# Altium project LIFT_DRIVER.PrjPcb
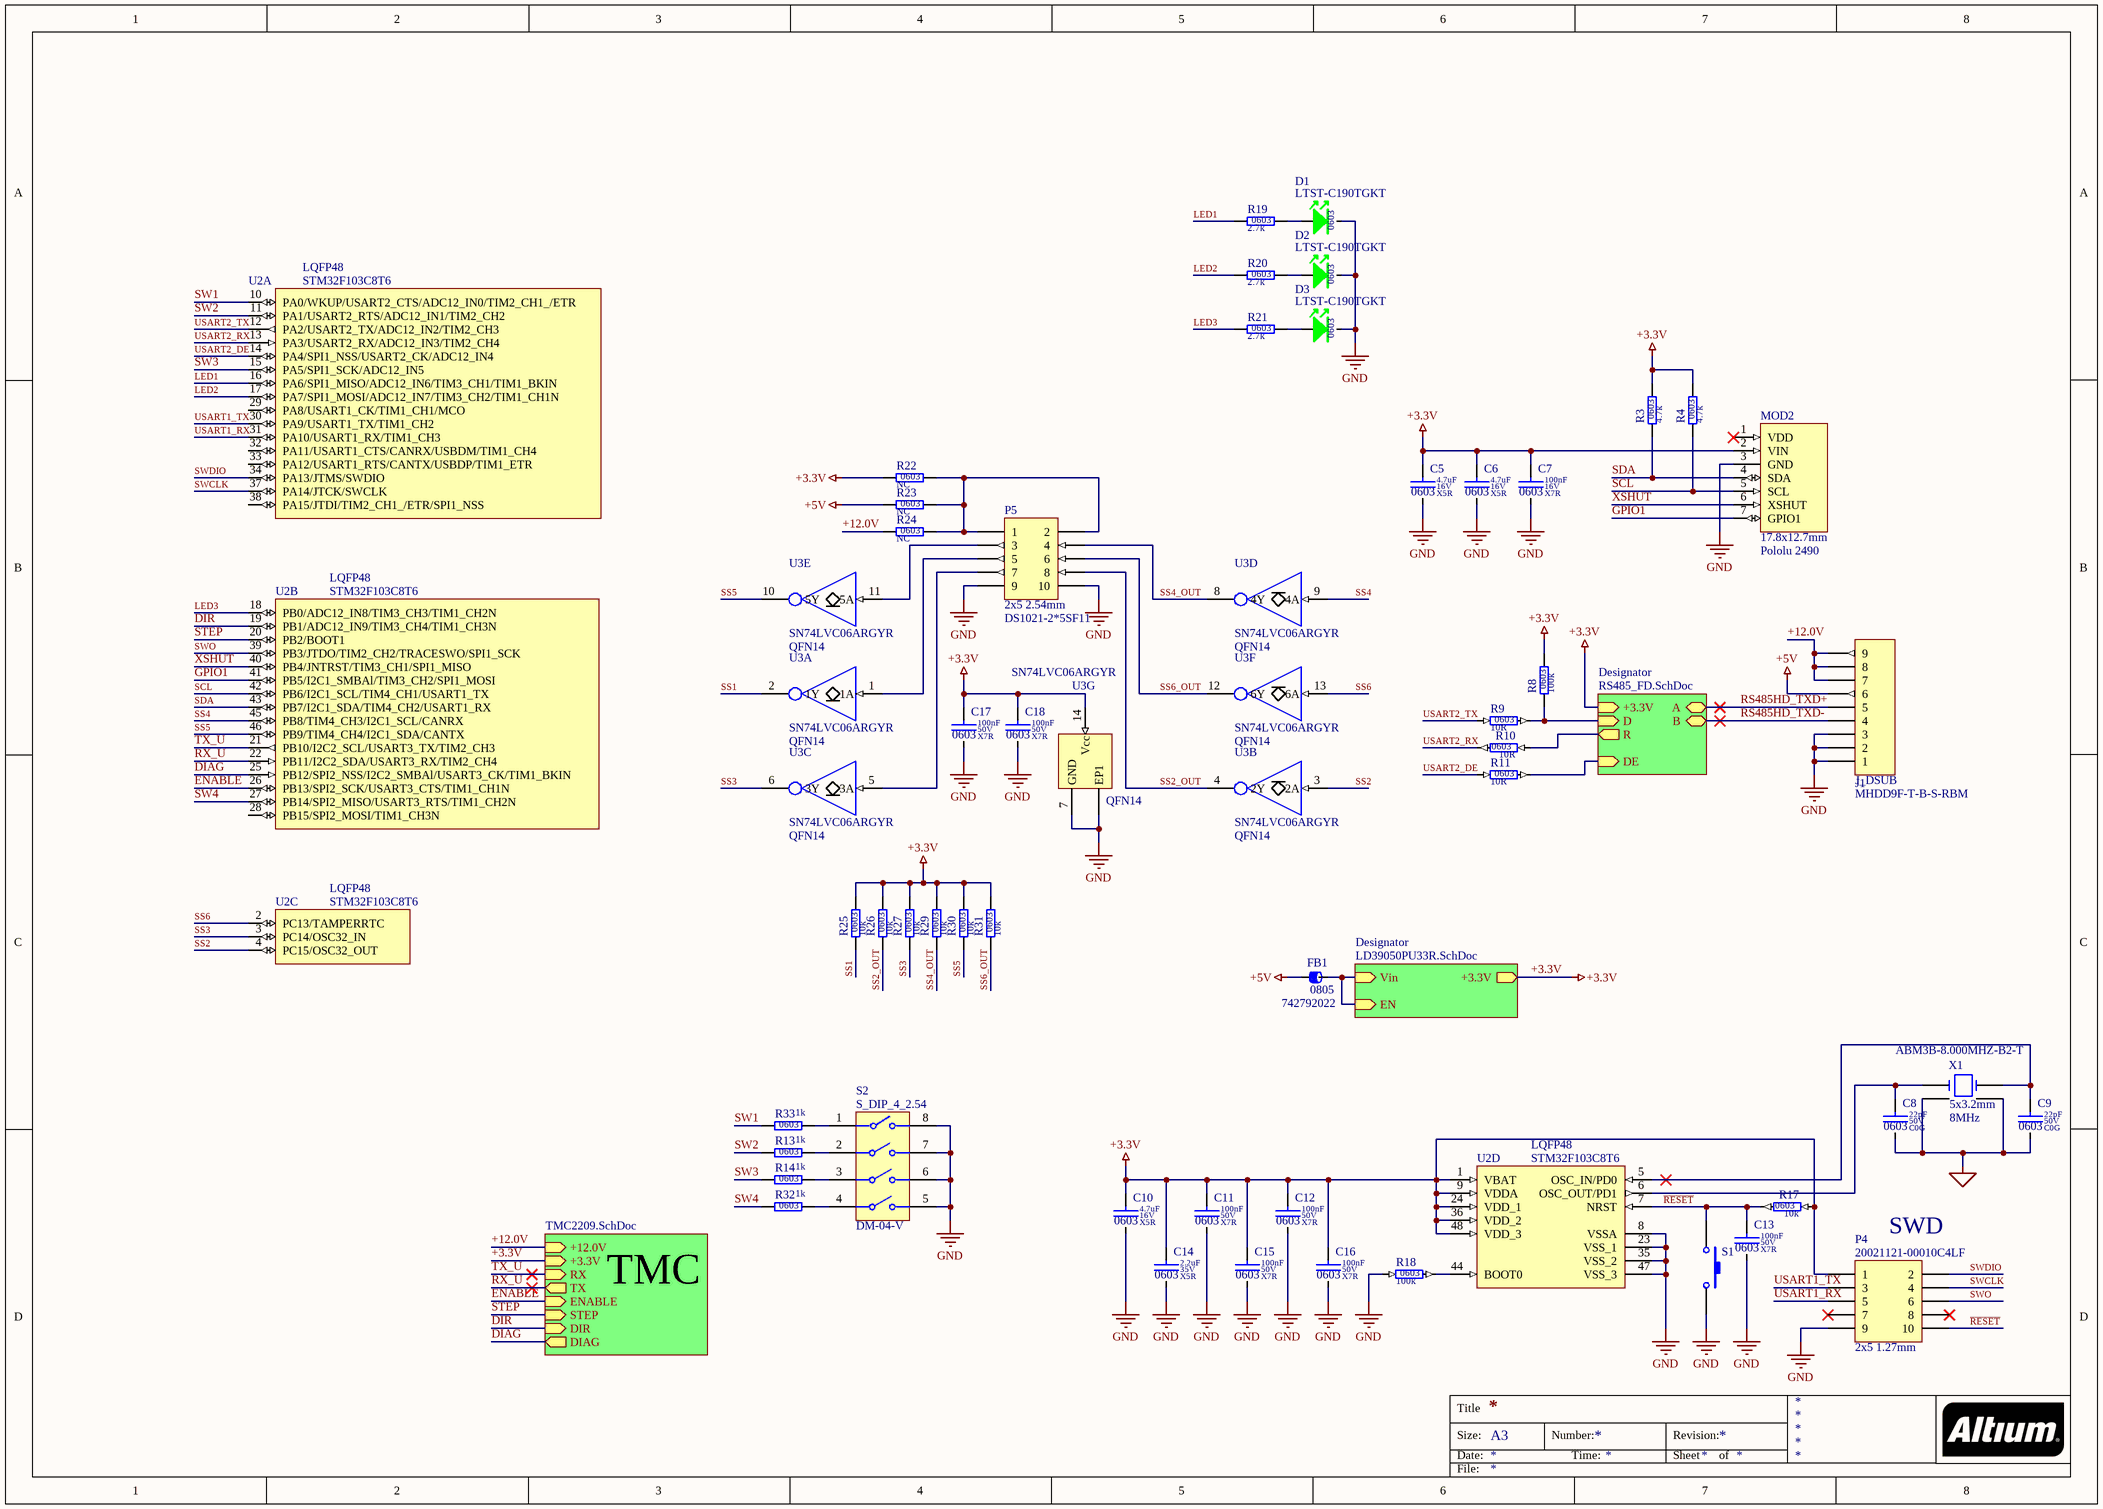
[diagram p0: LIFT_DRIVER.SchDoc]
4 sheets, 84 parts. Net scope: hierarchical (ports join the sheet entries above them; power ports are global).
Board file: LIFT_DRIVER.PcbDoc
Sheets:
  LIFT_DRIVER.SchDoc
    Designator = TMC2209.SchDoc
    Designator = LD39050PU33R.SchDoc
  protection.SchDoc

## Sheet LIFT_DRIVER.SchDoc
size A3

### Parts
C5  value 4.7uF  Dielectric: X5R  Voltage: 16V  SCH_Footprint: 0603  [C_0603_1608]  (hidden comment: Ceramic X5R)
C6  value 4.7uF  Dielectric: X5R  Voltage: 16V  SCH_Footprint: 0603  [C_0603_1608]  (hidden comment: Ceramic X5R)
C7  value 100nF  Dielectric: X7R  Voltage: 16V  SCH_Footprint: 0603  [C_0603_1608]  (hidden comment: Ceramic X7R)
C8  value 22pF  Dielectric: C0G  Voltage: 50V  SCH_Footprint: 0603  [C_0603_1608]  (hidden comment: Ceramic C0G)
C9  value 22pF  Dielectric: C0G  Voltage: 50V  SCH_Footprint: 0603  [C_0603_1608]  (hidden comment: Ceramic C0G)
C10  value 4.7uF  Dielectric: X5R  Voltage: 16V  SCH_Footprint: 0603  [C_0603_1608]  (hidden comment: Ceramic X5R)
C11  value 100nF  Dielectric: X7R  Voltage: 50V  SCH_Footprint: 0603  [C_0603_1608]  (hidden comment: Ceramic X7R)
C12  value 100nF  Dielectric: X7R  Voltage: 50V  SCH_Footprint: 0603  [C_0603_1608]  (hidden comment: Ceramic X7R)
C13  value 100nF  Dielectric: X7R  Voltage: 50V  SCH_Footprint: 0603  [C_0603_1608]  (hidden comment: Ceramic X7R)
C14  value 2.2uF  Dielectric: X5R  Voltage: 35V  SCH_Footprint: 0603  [C_0603_1608]  (hidden comment: Ceramic X5R)
C15  value 100nF  Dielectric: X7R  Voltage: 50V  SCH_Footprint: 0603  [C_0603_1608]  (hidden comment: Ceramic X7R)
C16  value 100nF  Dielectric: X7R  Voltage: 50V  SCH_Footprint: 0603  [C_0603_1608]  (hidden comment: Ceramic X7R)
C17  value 100nF  Dielectric: X7R  Voltage: 50V  SCH_Footprint: 0603  [C_0603_1608]  (hidden comment: Ceramic X7R)
C18  value 100nF  Dielectric: X7R  Voltage: 50V  SCH_Footprint: 0603  [C_0603_1608]  (hidden comment: Ceramic X7R)
D1  value LTST-C190TGKT  SCH_Footprint: 0603  [OL_0603_1608]  (hidden comment: Green Led)
D2  value LTST-C190TGKT  SCH_Footprint: 0603  [OL_0603_1608]  (hidden comment: Green Led)
D3  value LTST-C190TGKT  SCH_Footprint: 0603  [OL_0603_1608]  (hidden comment: Green Led)
FB1  value 742792022  SCH_Footprint: 0805  [FB_0805_2012]  (hidden comment: Ferrite bead)
J1  value MHDD9F-T-B-S-RBM  [J_DSUB_MHDD9F-T-B-S-RBM]  (hidden comment: DSUB 9 Pin)
MOD2  value Pololu 2490  SCH_Footprint: 17.8x12.7mm  [MOD_VL53L0X]  (hidden comment: time-of-flight)
P4  value 20021121-00010C4LF  SCH_Footprint: 2x5 1.27mm  [P_HEADER_2x5_1.27]  (hidden comment: Jtag)
P5  value DS1021-2*5SF11  SCH_Footprint: 2x5 2.54mm  [P_HEADER_2x5_2.54]  (hidden comment: Goldpin male)
R3  value 4.7k  SCH_Footprint: 0603  [R_0603_1608]  (hidden comment: Resistor)
R4  value 4.7k  SCH_Footprint: 0603  [R_0603_1608]  (hidden comment: Resistor)
R8  value 100k  SCH_Footprint: 0603  [R_0603_1608]  (hidden comment: Resistor)
R9  value 10R  SCH_Footprint: 0603  [R_0603_1608]  (hidden comment: Resistor)
R10  value 10R  SCH_Footprint: 0603  [R_0603_1608]  (hidden comment: Resistor)
R11  value 10R  SCH_Footprint: 0603  [R_0603_1608]  (hidden comment: Resistor)
R13  value 1k  SCH_Footprint: 0603  [R_0603_1608]  (hidden comment: Resistor)
R14  value 1k  SCH_Footprint: 0603  [R_0603_1608]  (hidden comment: Resistor)
R17  value 10k  SCH_Footprint: 0603  [R_0603_1608]  (hidden comment: Resistor)
R18  value 100k  SCH_Footprint: 0603  [R_0603_1608]  (hidden comment: Resistor)
R19  value 2.7k  SCH_Footprint: 0603  [R_0603_1608]  (hidden comment: Resistor)
R20  value 2.7k  SCH_Footprint: 0603  [R_0603_1608]  (hidden comment: Resistor)
R21  value 2.7k  SCH_Footprint: 0603  [R_0603_1608]  (hidden comment: Resistor)
R22  value NC  SCH_Footprint: 0603  [R_NC_0603_1608]  (hidden comment: Resistor)
R23  value NC  SCH_Footprint: 0603  [R_NC_0603_1608]  (hidden comment: Resistor)
R24  value NC  SCH_Footprint: 0603  [R_NC_0603_1608]  (hidden comment: Resistor)
R25  value 10k  SCH_Footprint: 0603  [R_0603_1608]  (hidden comment: Resistor)
R26  value 10k  SCH_Footprint: 0603  [R_0603_1608]  (hidden comment: Resistor)
R27  value 10k  SCH_Footprint: 0603  [R_0603_1608]  (hidden comment: Resistor)
R29  value 10k  SCH_Footprint: 0603  [R_0603_1608]  (hidden comment: Resistor)
R30  value 10k  SCH_Footprint: 0603  [R_0603_1608]  (hidden comment: Resistor)
R31  value 10k  SCH_Footprint: 0603  [R_0603_1608]  (hidden comment: Resistor)
R32  value 1k  SCH_Footprint: 0603  [R_0603_1608]  (hidden comment: Resistor)
R33  value 1k  SCH_Footprint: 0603  [R_0603_1608]  (hidden comment: Resistor)
S1  3x6mm  [S_TACTSWITCH3x6]  (value not drawn)
S2  value DM-04-V  SCH_Footprint: S_DIP_4_2.54  [DM-04-V]  (hidden comment: DIP SWITCH 4 POS)
U2  SCH_Footprint: LQFP48  [LQFP48_7x7]  (hidden comment: STM32F103C8T6)  (parts A,B,C,D of 4)
U3  value SN74LVC06ARGYR  SCH_Footprint: QFN14  [QFN14_4x4]  (hidden comment: Open drain buffer)  (parts A,B,C,D,E,F,G of 7)
X1  Manufacturer Part Number: ABM3B-8.000MHZ-B2-T  SCH_Footprint: 5x3.2mm  [X_ABM3B_5X3X11]  (hidden comment: 8MHz)

### Sub-sheets
Designator = RS485_FD.SchDoc (file not in this document): +3.3V (in), R (out), D (in), DE (in), A (bidir), B (bidir)
Designator = TMC2209.SchDoc: TX (out), +3.3V (in), RX (in), DIR (in), STEP (in), +12.0V (in), DIAG (out), ENABLE (in)
Designator = LD39050PU33R.SchDoc: Vin (in), +3.3V (out), EN (in)

### Nets
+3.3V: C5.1 C6.1 C7.1 C10.1 C11.1 C12.1 C14.1 C15.1 C16.1 C17.1 C18.1 MOD2.2(VIN) P4.1 R3.2 R4.2 R8.2 R17.1 R22.1 R25.2 R26.2 R27.2 R29.2 R30.2 R31.2 U2.1(VBAT) U2.9(VDDA) U2.24(VDD_1) U2.36(VDD_2) U2.48(VDD_3) U3.14(Vcc) ; sheet Designator/+3.3V, sheet Designator/+3.3V, sheet Designator/+3.3V
+5V: FB1.1 J1.6 R23.1
GND: C5.2 C6.2 C7.2 C8.2 C9.2 C10.2 C11.2 C12.2 C13.2 C14.2 C15.2 C16.2 C17.2 C18.2 D1.1(K) D2.1(K) D3.1(K) J1.1 J1.2 J1.3 MOD2.3(GND) P4.9 P5.9 P5.10 R18.1 S1.2 S2.5 S2.6 S2.7 S2.8 U2.8(VSSA) U2.23(VSS_1) U2.35(VSS_2) U2.47(VSS_3) U3.7(GND) U3.EP1 X1.2(GND) X1.4(GND)
+12.0V: J1.7 J1.8 J1.9 R24.1 ; sheet Designator/+12.0V
DIAG: U2.25(PB12/SPI2_NSS/I2C2_SMBAl/USART3_CK/TIM1_BKIN) ; sheet Designator/DIAG
DIR: U2.19(PB1/ADC12_IN9/TIM3_CH4/TIM1_CH3N) ; sheet Designator/DIR
ENABLE: U2.26(PB13/SPI2_SCK/USART3_CTS/TIM1_CH1N) ; sheet Designator/ENABLE
GPIO1: MOD2.7(GPIO1) U2.41(PB5/I2C1_SMBAl/TIM3_CH2/SPI1_MOSI)
LD_IN: FB1.2 ; sheet Designator/Vin, sheet Designator/EN
LED1: R19.1 U2.16(PA6/SPI1_MISO/ADC12_IN6/TIM3_CH1/TIM1_BKIN)
LED2: R20.1 U2.17(PA7/SPI1_MOSI/ADC12_IN7/TIM3_CH2/TIM1_CH1N)
LED3: R21.1 U2.18(PB0/ADC12_IN8/TIM3_CH3/TIM1_CH2N)
~{RESET}: C13.1 P4.10 R17.2 S1.1 U2.7(NRST)
RS485HD_TXD+: J1.5 ; sheet Designator/A
RS485HD_TXD-: J1.4 ; sheet Designator/B
RX_U: U2.22(PB11/I2C2_SDA/USART3_RX/TIM2_CH4) ; sheet Designator/TX
SCL: MOD2.5(SCL) R4.1 U2.42(PB6/I2C1_SCL/TIM4_CH1/USART1_TX)
SDA: MOD2.4(SDA) R3.1 U2.43(PB7/I2C1_SDA/TIM4_CH2/USART1_RX)
SS1: R25.1 U3.2(1Y)
SS2: U2.4(PC15/OSC32_OUT) U3.3(2A)
SS2_OUT: P5.8 R26.1 U3.4(2Y)
SS3: R27.1 U2.3(PC14/OSC32_IN) U3.6(3Y)
SS4: U2.45(PB8/TIM4_CH3/I2C1_SCL/CANRX) U3.9(4A)
SS4_OUT: P5.4 R29.1 U3.8(4Y)
SS5: R30.1 U2.46(PB9/TIM4_CH4/I2C1_SDA/CANTX) U3.10(5Y)
SS6: U2.2(PC13/TAMPERRTC) U3.13(6A)
SS6_OUT: P5.6 R31.1 U3.12(6Y)
STEP: U2.20(PB2/BOOT1) ; sheet Designator/STEP
SW1: R33.1 U2.10(PA0/WKUP/USART2_CTS/ADC12_IN0/TIM2_CH1_/ETR)
SW2: R13.1 U2.11(PA1/USART2_RTS/ADC12_IN1/TIM2_CH2)
SW3: R14.1 U2.15(PA5/SPI1_SCK/ADC12_IN5)
SW4: R32.1 U2.27(PB14/SPI2_MISO/USART3_RTS/TIM1_CH2N)
SWCLK: P4.4 U2.37(PA14/JTCK/SWCLK)
SWDIO: P4.2 U2.34(PA13/JTMS/SWDIO)
SWO: P4.6 U2.39(PB3/JTDO/TIM2_CH2/TRACESWO/SPI1_SCK)
TX_U: U2.21(PB10/I2C2_SCL/USART3_TX/TIM2_CH3) ; sheet Designator/RX
USART1_RX: P4.5 U2.31(PA10/USART1_RX/TIM1_CH3)
USART1_TX: P4.3 U2.30(PA9/USART1_TX/TIM1_CH2)
USART2_DE: R11.1 U2.14(PA4/SPI1_NSS/USART2_CK/ADC12_IN4)
USART2_RX: R10.2 U2.13(PA3/USART2_RX/ADC12_IN3/TIM2_CH4)
USART2_TX: R9.1 U2.12(PA2/USART2_TX/ADC12_IN2/TIM2_CH3)
XSHUT: MOD2.6(XSHUT) U2.40(PB4/JNTRST/TIM3_CH1/SPI1_MISO)
NetC8_1: C8.1 U2.6(OSC_OUT/PD1) X1.3
NetC9_1: C9.1 U2.5(OSC_IN/PD0) X1.1
NetD1_2: D1.2(A) R19.2
NetD2_2: D2.2(A) R20.2
NetD3_2: D3.2(A) R21.2
NetP5_1: P5.1 P5.2 R22.2 R23.2 R24.2
NetP5_3: P5.3 U3.11(5A)
NetP5_5: P5.5 U3.1(1A)
NetP5_7: P5.7 U3.5(3A)
NetR8_1: R8.1 R9.2 ; sheet Designator/D
NetR10_1: R10.1 ; sheet Designator/R
NetR11_2: R11.2 ; sheet Designator/DE
NetR13_2: R13.2 S2.2
NetR14_2: R14.2 S2.3
NetR18_2: R18.2 U2.44(BOOT0)
NetR32_2: R32.2 S2.4
NetR33_2: R33.2 S2.1

Not connected (* = marked no-connect by the designer): J1 0(NC); MOD2 1(VDD)*; P4 7* 8*; U2 28(PB15/SPI2_MOSI/TIM1_CH3N) 29(PA8/USART1_CK/TIM1_CH1/MCO) 32(PA11/USART1_CTS/CANRX/USBDM/TIM1_CH4) 33(PA12/USART1_RTS/CANTX/USBDP/TIM1_ETR) 38(PA15/JTDI/TIM2_CH1_/ETR/SPI1_NSS)

### Notes on the sheet
- (near P4) SWD
- TMC
- Title
- Size:
- Date:
- A3
- Number:
- Time:
- Revision:
- Sheet
- of
- File:

### Library data of the parts
C5 C6 C10 = C_4.7uF_16V_X5R_0603_10: Capacitor; Manufacturer: Murata; Manufacturer Part Number: GRM188R61C475KAAJD; Tolerance (%): 10; Part Number: C_4.7uF_16V_X5R_0603_10; HelpURL: https://datasheet.octopart.com/GRM188R61C475KAAJD-Murata-datasheet-66077093.pdf; Supplier 1: TME; Supplier 2: RS Components; Supplier Part Number 2: 884-7264P; Supplier 3: Farnell; Supplier Part Number 3: 2611924; Supplier 4: Mouser; Supplier Part Number 4: 81-GRM188R61C475KAJD; Supplier 5: Digi-Key; Supplier Part Number 5: 490-10481-2-ND
  C5 C6: Supplier 6: LCSC
C7 = C_100nF_16V_X7R_0603_10: Capacitor; Manufacturer: Kemet; Manufacturer Part Number: C0603C104K4RAC7013; Tolerance (%): 10; Part Number: C_100nF_16V_X7R_0603_10; HelpURL: https://pl.mouser.com/datasheet/2/212/KEM_C1002_X7R_SMD-1102033.pdf; Supplier 1: TME; Supplier 2: RS Components; Supplier 3: Farnell; Supplier 4: Mouser; Supplier Part Number 4: 80-C0603C104K4RC7013; Supplier 5: Digi-Key; Supplier Part Number 5: 399-7372-2-ND; Supplier 6: LCSC
C8 C9 = C_22pF_50V_C0G_0603_5: Capacitor; Manufacturer: AVX; Manufacturer Part Number: 06035A220JAT2A; Tolerance (%): 5; Part Number: C_22pF_50V_C0G_0603_5; HelpURL: https://datasheet.octopart.com/06035A220JAT2A-AVX-datasheet-9883399.pdf; Supplier 1: TME; Supplier 2: RS Components; Supplier Part Number 2: 1349628; Supplier 3: Farnell; Supplier Part Number 3: 2280861; Supplier 4: Mouser; Supplier Part Number 4: 581-06035A220J; Supplier 5: Digi-Key; Supplier Part Number 5: 478-1167-1-ND
C11-C13 C15-C18 = C_100nF_50V_X7R_0603_5: Capacitor; Manufacturer: Samsung; Manufacturer Part Number: CL10B104JB8NNNC; Tolerance (%): 5; Part Number: C_100nF_50V_X7R_0603_5; HelpURL: http://www.tme.eu/pl/Document/4a42202b32dab16128fe107dd69598cc/samsung-chip-cap.pdf; Supplier 1: TME; Supplier Part Number 1: CL10B104JB8NNNC; Supplier 2: RS Components; Supplier 3: Farnell; Supplier 4: Mouser; Supplier 5: Digi-Key
C14 = C_2.2uF_35V_X5R_0603_10: Capacitor; Manufacturer: Murata; Manufacturer Part Number: GRM188R6YA225KA12D; Tolerance (%): 10; Part Number: C_2.2uF_35V_X5R_0603_10; HelpURL: https://datasheet.octopart.com/GRM188R6YA225KA12D-Murata-datasheet-66077095.pdf; Supplier 1: TME; Supplier 2: RS Components; Supplier Part Number 2: 8151358; Supplier 3: Farnell; Supplier Part Number 3: 2611926; Supplier 4: Mouser; Supplier Part Number 4: 81-GRM188R6YA225KA2D; Supplier 5: Digi-Key; Supplier Part Number 5: 490-7204-1-ND
D1-D3 = OL_G_0603: LED GREEN; Manufacturer: Lite-On; Part Number: OL_G_0603; HelpURL: https://datasheet.octopart.com/LTST-C190TGKT-Lite-On-datasheet-158437.pdf; Manufacturer Part Number: LTST-C190TGKT; Supplier 1: TME; Supplier Part Number 1: LTST-C190TGKT; Supplier 2: RS Components; Supplier Part Number 2: 6920997P; Supplier 3: Farnell; Supplier 4: Mouser; Supplier Part Number 4: 859-LTST-C190TGKT; Supplier 5: Digi-Key; Supplier Part Number 5: 160-2019-1-ND
FB1 = FB_742792022: Manufacturer: Wurth; Current: 2A; Resistance: 50mR; Part Number: FB_742792022; HelpURL: http://www.farnell.com/datasheets/1919973.pdf?_ga=2.197269935.1851800069.1516124392-930414557.1508304960; Manufacturer Part Number: 742792022; Supplier 1: TME; Supplier 2: RS Components; Supplier 3: Farnell; Supplier Part Number 3: 1635733; Supplier 4: Mouser; Supplier 5: Digi-Key
J1 = J_DSUB: Header, 9-Pin; SCH_Footprint: J_DSUB; Part Number: J_DSUB; Component Type: Standard; HelpURL: https://www.tme.eu/Document/d24efe21bdaa08410b5ca50a678e1de1/MHDDXX-F-T-B-S-RBM.PDF; Manufacturer: -; Manufacturer Part Number: MHDD9F-T-B-S-RBM; Supplier 1: TME; Supplier Part Number 1: MHDD9F-T-B-S-RBM; Supplier 2: RS Components; Supplier 3: Farnell; Supplier Part Number 3: 2533067; Supplier 4: Mouser; Supplier 5: Digi-Key
MOD2 = MOD_VL53L0X: Pin Header; Manufacturer: Polulu; Part Number: MOD_VL53L0X; HelpURL: https://www.pololu.com/file/download/VL53L0X.pdf?file_id=0J1187; Manufacturer Part Number: Pololu 2490; Supplier 1: TME; Supplier 2: RS Components; Supplier 3: Farnell; Supplier 4: Mouser; Supplier 5: Digi-Key; Supplier 6: LCSC; Supplier 7: Botland; Supplier Part Number 7: PLL-07176
P4 = P_HEADER_2x5_1.27: Header, 10-Pin, Dual row; Manufacturer: FCI; Part Number: P_HEADER_2x5_1.27; Component Type: Standard; HelpURL: http://www.mouser.com/catalog/645/usd/1591.pdf; Manufacturer Part Number: 20021121-00010C4LF; Supplier 1: TME; Supplier Part Number 1: 20021121-00010C4LF; Supplier 2: RS Components; Supplier Part Number 2: 794-4584; Supplier 3: Farnell; Supplier Part Number 3: 1865279; Supplier 4: Mouser; Supplier Part Number 4: 649-202112100010C4LF; Supplier 5: Digi-Key; Supplier Part Number 5: 609-3695-1-ND
P5 = P_HEADER_2x5_2.54: Pin Header; Manufacturer: Connfly; Part Number: P_HEADER_2x5_2.54; Component Type: Standard; HelpURL: https://www.tme.eu/Document/cc301e58a5da78cb543a94b5a5b7f06a/DS1021.pdf; Manufacturer Part Number: DS1021-2*5SF11; Supplier 1: TME; Supplier Part Number 1: ZL202-10G; Supplier 2: RS Components; Supplier 3: Farnell; Supplier 4: Mouser; Supplier 5: Digi-Key
R3 R4 = R_4.7k_0603_1: Manufacturer: Yageo; Manufacturer Part Number: RC0603FR-074K7L; Voltage: 75V; Power: 100mW; Tolerance: 1%; Part Number: R_4.7k_0603_1; HelpURL: http://www.farnell.com/datasheets/2167052.pdf?_ga=2.156163131.1690599162.1548417389-1379097396.1542296996&_gac=1.18389067.1547230258.Cj0KCQiAmuHhBRD0ARIsAFWyPwhX8HcvXnM3tA0ZBodZLzDIjH2ZxLpjT5LWo9bad_HPRbU8LfPq44UaAhEwEALw_wcB; Supplier 1: TME; Supplier Part Number 1: RC0603FR-074K7; Supplier 2: RS Components; Supplier 3: Farnell; Supplier Part Number 3: 9238565; Supplier 4: Mouser; Supplier Part Number 4: 603-RC0603FR-074K7L; Supplier 5: Digi-Key; Supplier Part Number 5: 311-4.70KHRCT-ND; Supplier 6: LCSC
R8 R18 = R_100k_0603_1: Manufacturer: Royalohm; Manufacturer Part Number: 0603SAF1003T5E; Voltage: 50V; Power: 100mW; Tolerance: 1%; Part Number: R_100k_0603_1; HelpURL: http://www.tme.eu/pl/Document/b315665a56acbc42df513c99b390ad98/ROYALOHM-THICKFILM.pdf; Supplier 1: TME; Supplier Part Number 1: SMD0603-100K-1%; Supplier 2: RS Components; Supplier 3: Farnell; Supplier 4: Mouser; Supplier Part Number 4: 667-ERJ-3EKF1003V; Supplier 5: Digi-Key; Supplier Part Number 5: P100KHCT-ND
  R8: Supplier 6: LCSC
R9-R11 = R_10R_0603_1: Manufacturer: Royalohm; Manufacturer Part Number: 0603SAF100JT5E; Voltage: 50V; Power: 100mW; Tolerance: 1%; Part Number: R_10R_0603_1; HelpURL: http://www.tme.eu/pl/Document/b315665a56acbc42df513c99b390ad98/ROYALOHM-THICKFILM.pdf; Supplier 1: TME; Supplier Part Number 1: SMD0603-10R-1%; Supplier 2: RS Components; Supplier 3: Farnell; Supplier 4: Mouser; Supplier 5: Digi-Key
R13 R14 R32 R33 = R_1k_0603_1: Manufacturer: Vishay; Manufacturer Part Number: CRCW06031K00FKEA; Voltage: 75V; Power: 100mW; Tolerance: 1%; Part Number: R_1k_0603_1; HelpURL: http://www.farnell.com/datasheets/2310790.pdf?_ga=2.256888843.1690599162.1548417389-1379097396.1542296996&_gac=1.262631934.1547230258.Cj0KCQiAmuHhBRD0ARIsAFWyPwhX8HcvXnM3tA0ZBodZLzDIjH2ZxLpjT5LWo9bad_HPRbU8LfPq44UaAhEwEALw_wcB; Supplier 1: TME; Supplier 2: RS Components; Supplier Part Number 2: 678-9875P; Supplier 3: Farnell; Supplier Part Number 3: 1469740; Supplier 4: Mouser; Supplier Part Number 4: 71-CRCW0603-1.0K-E3; Supplier 5: Digi-Key; Supplier Part Number 5: 541-1.00KHCT-ND; Supplier 6: LCSC
R17 R25-R27 R29-R31 = R_10k_0603_1: Manufacturer: Vishay; Manufacturer Part Number: CRCW060310K0FKTABC; Voltage: 75V; Power: 100mW; Tolerance: 1%; Part Number: R_10k_0603_1; HelpURL: http://www.tme.eu/pl/Document/622e28308c06d160637f2b14751ba16b/Data%20Sheet%20CRCW_BCe3.pdf; Supplier 1: TME; Supplier Part Number 1: CRCW060310K0FKTABC; Supplier 2: RS Components; Supplier 3: Farnell; Supplier 4: Mouser; Supplier Part Number 4: 667-ERJ-3EKF1002V; Supplier 5: Digi-Key; Supplier Part Number 5: P10KGCT-ND
  R25-R27 R29-R31: Supplier 6: LCSC
R19-R21 = R_2.7k_0603_1: Manufacturer: Royalohm; Manufacturer Part Number: 0603SAF2701T5E; Voltage: 50V; Power: 100mW; Tolerance: 1%; Part Number: R_2.7k_0603_1; HelpURL: http://www.tme.eu/pl/Document/b315665a56acbc42df513c99b390ad98/ROYALOHM-THICKFILM.pdf; Supplier 1: TME; Supplier Part Number 1: SMD0603-2K7-1%; Supplier 2: RS Components; Supplier 3: Farnell; Supplier 4: Mouser; Supplier 5: Digi-Key
R22-R24 = R_GENERIC_0603: Part Number: R_GENERIC_0603; Supplier 1: TME; Supplier 2: RS Components; Supplier 3: Farnell; Supplier 4: Mouser; Supplier 5: Digi-Key
S1 = S_TACTSWITCH: Tact Switch; Manufacturer: Ninigi; Manufacturer Part Number: TACTM-34N-F; Part Number: S_TACTSWITCH; HelpURL: http://pl.ninigi.com/product/tactm-34n-f/pdf; Supplier 1: TME; Supplier Part Number 1: TACTM-34N-F; Supplier 2: RS Components; Supplier 3: Farnell; Supplier 4: Mouser; Supplier 5: Digi-Key
S2 = S_DM-04-V: Manufacturer: DIPTRONICS; Part Number: S_DM-04-V; HelpURL: https://www.tme.eu/pl/Document/3859235cbbc3386afa52bad431a134f4/DM-SERIES.pdf; Manufacturer Part Number: DM-04-V; Supplier 1: TME; Supplier Part Number 1: ESD104E; Supplier 2: RS Components; Supplier 3: Farnell; Supplier 4: Mouser; Supplier Part Number 4: 113-DM04VTR; Supplier 5: Digi-Key; Supplier 6: LCSC
U2 = UP_STM32F103C8T6: Manufacturer: STMicroelectronics; Value: STM32F103C8T6; Part Number: UP_STM32F103C8T6; HelpURL: https://datasheet.octopart.com/STM32F103C8T6-STMicroelectronics-datasheet-48026265.pdf; Manufacturer Part Number: STM32F103C8T6; Supplier 1: TME; Supplier Part Number 1: STM32F103C8T6; Supplier 2: RS Components; Supplier Part Number 2: 1023545; Supplier 3: Farnell; Supplier Part Number 3: 1447637; Supplier 4: Mouser; Supplier Part Number 4: 511-STM32F103C8T6; Supplier 5: Digi-Key; Supplier Part Number 5: 497-6063-ND; Supplier 6: LCSC
U3 = U_SN74LVC06ARGYR: Manufacturer: Texas Instruments; Part Number: U_SN74LVC06ARGYR; HelpURL: http://www.ti.com/lit/ds/symlink/sn74lvc06a.pdf; Manufacturer Part Number: SN74LVC06ARGYR; Supplier 1: TME; Supplier 2: RS Components; Supplier 3: Farnell; Supplier 4: Mouser; Supplier Part Number 4: 595-SN74LVC06ARGYR; Supplier 5: Digi-Key; Supplier Part Number 5: 296-13957-1-ND
X1 = X_ABM3B-8.000MHZ-B2-T: Manufacturer: Abracon; Part Number: X_ABM3B-8.000MHZ-B2-T; Value: 8MHz; HelpURL: https://datasheet.octopart.com/ABM3B-8.000MHZ-B2-T-Abracon-datasheet-12510201.pdf; Supplier 1: TME; Supplier Part Number 1: ABM3B-8.000MHZ-B2; Supplier 2: RS Components; Supplier Part Number 2: 171-0644; Supplier 3: Farnell; Supplier Part Number 3: 2467818; Supplier 4: Mouser; Supplier Part Number 4: 815-ABM3B-8.0-B2-T; Supplier 5: Digi-Key; Supplier Part Number 5: 535-9720-1-ND

## Sheet TMC2209.SchDoc
size A4
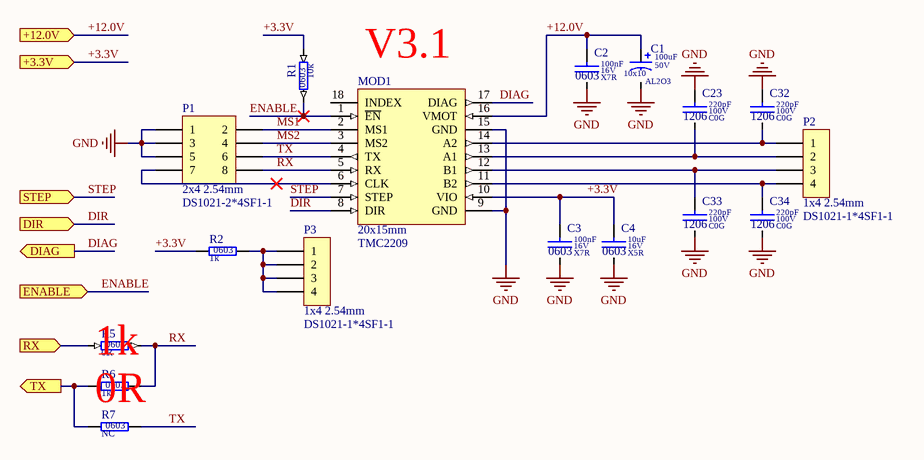
[diagram p1: TMC2209.SchDoc]

### Parts
C1  value 100uF  Dielectric: AL2O3  SCH_Footprint: 10x10  Voltage: 50V  [CE_D_10x10MM]  (hidden comment: Electrolytic Capacitor)
C2  value 100nF  Dielectric: X7R  Voltage: 16V  SCH_Footprint: 0603  [C_0603_1608]  (hidden comment: Ceramic X7R)
C3  value 100nF  Dielectric: X7R  Voltage: 16V  SCH_Footprint: 0603  [C_0603_1608]  (hidden comment: Ceramic X7R)
C4  value 10uF  Dielectric: X5R  Voltage: 16V  SCH_Footprint: 0603  [C_0603_1608]  (hidden comment: Ceramic X5R)
C23  value 220pF  Dielectric: C0G  Voltage: 100V  SCH_Footprint: 1206  [C_1206_3216]  (hidden comment: Ceramic C0G)
C32  value 220pF  Dielectric: C0G  Voltage: 100V  SCH_Footprint: 1206  [C_1206_3216]  (hidden comment: Ceramic C0G)
C33  value 220pF  Dielectric: C0G  Voltage: 100V  SCH_Footprint: 1206  [C_1206_3216]  (hidden comment: Ceramic C0G)
C34  value 220pF  Dielectric: C0G  Voltage: 100V  SCH_Footprint: 1206  [C_1206_3216]  (hidden comment: Ceramic C0G)
MOD1  value TMC2209  SCH_Footprint: 20x15mm  [MOD_TMC2209]  (hidden comment: The TMC2209 is an ultra-silent motor driver IC for two phase stepper motors.)
P1  value DS1021-2*4SF1-1  SCH_Footprint: 2x4 2.54mm  [P_HEADER_2x4_2.54]  (hidden comment: Goldpin male)
P2  value DS1021-1*4SF1-1  SCH_Footprint: 1x4 2.54mm  [P_HEADER_1x4_2.54]  (hidden comment: Goldpin)
P3  value DS1021-1*4SF1-1  SCH_Footprint: 1x4 2.54mm  [P_HEADER_1x4_2.54]  (hidden comment: Goldpin)
R1  value 10k  SCH_Footprint: 0603  [R_0603_1608]  (hidden comment: Resistor)
R2  value 1k  SCH_Footprint: 0603  [R_0603_1608]  (hidden comment: Resistor)
R5  value 0R  SCH_Footprint: 0603  [R_0603_1608]  (hidden comment: Resistor)
R6  value 1k  SCH_Footprint: 0603  [R_0603_1608]  (hidden comment: Resistor)
R7  value NC  SCH_Footprint: 0603  [R_NC_0603_1608]  (hidden comment: Resistor)

### Ports
+3.3V (in), +12.0V (in), DIAG (out), DIR (in), ENABLE (in), RX (in), STEP (in), TX (out)

### Nets
+3.3V: C3.1 C4.1 MOD1.10(VIO) R1.1 R2.1 ; port +3.3V
GND: C1.2 C2.2 C3.2 C4.2 C23.1 C32.1 C33.2 C34.2 MOD1.9(GND) MOD1.15(GND) P1.1 P1.3 P1.5
+12.0V: C1.1 C2.1 MOD1.16(VMOT) ; port +12.0V
DIAG: MOD1.17(DIAG) ; port DIAG
DIR: MOD1.8(DIR) ; port DIR
ENABLE: MOD1.1(~{EN}) R1.2 ; port ENABLE
MS1: MOD1.2(MS1) P1.2
MS2: MOD1.3(MS2) P1.4
RX: MOD1.5(RX) P1.8 R5.2 R6.2
RX_U: R6.1 R7.1 ; port TX
STEP: MOD1.7(STEP) ; port STEP
TX: MOD1.4(TX) P1.6 R7.2
TX_U: R5.1 ; port RX
NetC23_2: C23.2 MOD1.13(A1) P2.2
NetC32_2: C32.2 MOD1.14(A2) P2.1
NetC33_1: C33.1 MOD1.12(B1) P2.3
NetC34_1: C34.1 MOD1.11(B2) P2.4
NetMOD1_6: MOD1.6(CLK) P1.7
NetP3_1: P3.1 P3.2 P3.3 P3.4 R2.2

Not connected (* = marked no-connect by the designer): MOD1 18(INDEX)

### Notes on the sheet
- (near MOD1) V3.1
- (near R5) 1k
- (near R6) 0R

### Library data of the parts
C1 = CE_100uF_50V_AL2O3_10x10_20: Polarized Capacitor; Manufacturer: Nichicon; Manufacturer Part Number: UUX1H101MNL1GS; Tolerance (%): 20; Part Number: CE_100uF_50V_AL2O3_10x10_20; HelpURL: https://datasheet.octopart.com/UUX1H101MNL1GS-Nichicon-datasheet-62047998.pdf; Supplier 1: TME; Supplier Part Number 1: UUX1H101MNL1GS; Supplier 2: RS Components; Supplier Part Number 2: 739-3107; Supplier 3: Farnell; Supplier Part Number 3: 2841943; Supplier 4: Mouser; Supplier Part Number 4: 647-UUX1H101MNL1GS; Supplier 5: Digi-Key; Supplier Part Number 5: 493-6269-1-ND; Supplier 6: LCSC
C2 C3 = C_100nF_16V_X7R_0603_10: as C7 on sheet LIFT_DRIVER; Part Number: C_100nF_16V_X7R_0603_10; HelpURL: https://pl.mouser.com/datasheet/2/212/KEM_C1002_X7R_SMD-1102033.pdf; Supplier 1: TME; Supplier 2: RS Components; Supplier 3: Farnell; Supplier 4: Mouser; Supplier Part Number 4: 80-C0603C104K4RC7013; Supplier 5: Digi-Key; Supplier Part Number 5: 399-7372-2-ND; Supplier 6: LCSC
C4 = C_10uF_16V_X5R_0603_20: Capacitor; Manufacturer: Samsung Electro-Mechanics; Manufacturer Part Number: CL10A106MO8NQNC; Tolerance (%): 20; Part Number: C_10uF_16V_X5R_0603_20; HelpURL: http://www.tme.eu/pl/Document/4a42202b32dab16128fe107dd69598cc/samsung-chip-cap.pdf; Supplier 1: TME; Supplier Part Number 1: CL10A106MO8NQNC; Supplier 2: RS Components; Supplier 3: Farnell; Supplier 4: Mouser; Supplier 5: Digi-Key; Supplier 6: LCSC
C23 C32-C34 = C_220pF_100V_C0G_1206_5: Capacitor; Manufacturer: AVX; Manufacturer Part Number: 12061A221JAT2A; Tolerance (%): 5; Part Number: C_220pF_100V_C0G_1206_5; HelpURL: https://datasheet.octopart.com/12061A221JAT2A-AVX-datasheet-9883399.pdf; Supplier 1: TME; Supplier Part Number 1: 12061A221JAT2A; Supplier 2: RS Components; Supplier Part Number 2: 1364313; Supplier 3: Farnell; Supplier Part Number 3: 499286; Supplier 4: Mouser; Supplier Part Number 4: 581-12061A221J; Supplier 5: Digi-Key; Supplier Part Number 5: 478-1446-1-ND; Supplier 6: LCSC
MOD1 = MOD_TMC2209: Manufacturer: Trinamic; Part Number: MOD_TMC2209; HelpURL: https://www.trinamic.com/fileadmin/assets/Products/ICs_Documents/TMC2209_Datasheet_V103.pdf; Manufacturer Part Number: TMC2209; Supplier 1: TME; Supplier 2: RS Components; Supplier 3: Farnell; Supplier Part Number 3: 3131532; Supplier 4: Mouser; Supplier Part Number 4: 700-TMC2209SILENTSTE; Supplier 5: Digi-Key; Supplier Part Number 5: 1460-1395-ND; Supplier 6: LCSC
P1 = P_HEADER_2x4_2.54: Pin Header; Manufacturer: Connfly; Part Number: P_HEADER_2x4_2.54; HelpURL: https://www.tme.eu/Document/cc301e58a5da78cb543a94b5a5b7f06a/DS1021.pdf; Manufacturer Part Number: DS1021-2*4SF1-1; Supplier 1: TME; Supplier Part Number 1: ZL202-8G; Supplier 2: RS Components; Supplier 3: Farnell; Supplier 4: Mouser; Supplier 5: Digi-Key; Supplier 6: LCSC
P2 P3 = P_HEADER_1x4_2.54: Pin Header; Manufacturer: Connfly; Part Number: P_HEADER_1x4_2.54; HelpURL: http://datasheet.octopart.com/DS1021-1%2A4SF1-1-Connfly-datasheet-65537859.pdf; Manufacturer Part Number: DS1021-1*4SF1-1; Supplier 1: TME; Supplier Part Number 1: ZL201-04G; Supplier 2: RS Components; Supplier 3: Farnell; Supplier 4: Mouser; Supplier 5: Digi-Key; Supplier 6: LCSC
R1 = R_10k_0603_1: as R17 on sheet LIFT_DRIVER; Part Number: R_10k_0603_1; HelpURL: http://www.tme.eu/pl/Document/622e28308c06d160637f2b14751ba16b/Data%20Sheet%20CRCW_BCe3.pdf; Supplier 1: TME; Supplier Part Number 1: CRCW060310K0FKTABC; Supplier 2: RS Components; Supplier 3: Farnell; Supplier 4: Mouser; Supplier Part Number 4: 667-ERJ-3EKF1002V; Supplier 5: Digi-Key; Supplier Part Number 5: P10KGCT-ND
R2 R6 = R_1k_0603_1: as R13 on sheet LIFT_DRIVER; Part Number: R_1k_0603_1; HelpURL: http://www.farnell.com/datasheets/2310790.pdf?_ga=2.256888843.1690599162.1548417389-1379097396.1542296996&_gac=1.262631934.1547230258.Cj0KCQiAmuHhBRD0ARIsAFWyPwhX8HcvXnM3tA0ZBodZLzDIjH2ZxLpjT5LWo9bad_HPRbU8LfPq44UaAhEwEALw_wcB; Supplier 1: TME; Supplier 2: RS Components; Supplier Part Number 2: 678-9875P; Supplier 3: Farnell; Supplier Part Number 3: 1469740; Supplier 4: Mouser; Supplier Part Number 4: 71-CRCW0603-1.0K-E3; Supplier 5: Digi-Key; Supplier Part Number 5: 541-1.00KHCT-ND; Supplier 6: LCSC
R5 = R_0R_0603_1: Manufacturer: Yageo; Manufacturer Part Number: RC0603FR-070RL; Voltage: 75V; Power: 100mW; Tolerance: 1%; Part Number: R_0R_0603_1; HelpURL: https://datasheet.octopart.com/RC0603FR-070RL-Yageo-datasheet-8328172.pdf; Supplier 1: TME; Supplier Part Number 1: RC0603FR-070RL; Supplier 2: RS Components; Supplier 3: Farnell; Supplier Part Number 3: 2309106; Supplier 4: Mouser; Supplier Part Number 4: 603-RC0603FR-070RL; Supplier 5: Digi-Key; Supplier Part Number 5: 311-0.0HRCT-ND; Supplier 6: LCSC; Supplier Part Number 6: C100044
R7 = R_GENERIC_0603: Part Number: R_GENERIC_0603; Supplier 1: TME; Supplier 2: RS Components; Supplier 3: Farnell; Supplier 4: Mouser; Supplier 5: Digi-Key; Supplier 6: LCSC

## Sheet LD39050PU33R.SchDoc
size A4
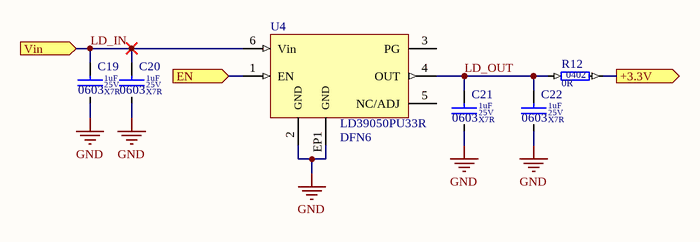
[diagram p2: LD39050PU33R.SchDoc]

### Parts
C19  value 1uF  Dielectric: X7R  Voltage: 25V  SCH_Footprint: 0603  [C_0603_1608]  (hidden comment: Ceramic X7R)
C20  value 1uF  Dielectric: X7R  Voltage: 25V  SCH_Footprint: 0603  [C_0603_1608]  (hidden comment: Ceramic X7R)
C21  value 1uF  Dielectric: X7R  Voltage: 25V  SCH_Footprint: 0603  [C_0603_1608]  (hidden comment: Ceramic X7R)
C22  value 1uF  Dielectric: X7R  Voltage: 25V  SCH_Footprint: 0603  [C_0603_1608]  (hidden comment: Ceramic X7R)
R12  value 0R  SCH_Footprint: 0402  [R_0402_1005]  (hidden comment: Resistor)
U4  SCH_Footprint: DFN6  [DFN6_3x3]  (hidden comment: LD39050PU33R)

### Ports
+3.3V (out), EN (in), Vin (in)

### Nets
+3.3V: R12.2 ; port +3.3V
GND: C19.2 C20.2 C21.2 C22.2 U4.2(GND) U4.EP1(GND)
LD_IN: C19.1 C20.1 U4.1(EN) U4.6(Vin) ; port Vin, port EN
LD_OUT: C21.1 C22.1 R12.1 U4.4(OUT)

Not connected (* = marked no-connect by the designer): U4 3(PG) 5(NC/ADJ)

### Library data of the parts
C19-C22 = C_1uF_25V_X7R_0603_10: Capacitor; Manufacturer: Samsung; Manufacturer Part Number: CL10B105KA8NNNC; Tolerance (%): 10; Part Number: C_1uF_25V_X7R_0603_10; HelpURL: http://www.tme.eu/pl/Document/4a42202b32dab16128fe107dd69598cc/samsung-chip-cap.pdf; Supplier 1: TME; Supplier Part Number 1: CL10B105KA8NNNC; Supplier 2: RS Components; Supplier 3: Farnell; Supplier 4: Mouser; Supplier 5: Digi-Key
R12 = R_0R_0402_5: Manufacturer: Yageo; Manufacturer Part Number: RC0402JR-070RL; Voltage: 50V; Power: 63mW; Tolerance: 5%; Part Number: R_0R_0402_5; HelpURL: https://datasheet.octopart.com/RC0402JR-070RL-Yageo-datasheet-10408619.pdf; Supplier 1: TME; Supplier Part Number 1: RC0402JR-070R; Supplier 2: RS Components; Supplier Part Number 2: 6185804; Supplier 3: Farnell; Supplier Part Number 3: 9232516; Supplier 4: Mouser; Supplier Part Number 4: 603-RC0402JR-070RL; Supplier 5: Digi-Key; Supplier Part Number 5: 311-0.0JRCT-ND; Supplier 6: LCSC; Supplier Part Number 6: C60485
U4 = VL_LD39050PU33R: Manufacturer: STMicroelectronics; Voltage: 3.3V; Current: 500mA; Value: LD39050PU33R; Part Number: VL_LD39050PU33R; HelpURL: https://www.tme.eu/pl/Document/062513da0f421ddb82a14a498f7bf1c8/LD39050.pdf; Manufacturer Part Number: LD39050PU33R; Supplier 1: TME; Supplier Part Number 1: LD39050PU33R; Supplier 2: RS Components; Supplier 3: Farnell; Supplier Part Number 3: 2762703; Supplier 4: Mouser; Supplier Part Number 4: 511-LD39050PU33R; Supplier 5: Digi-Key; Supplier Part Number 5: 497-8716-1-ND

## Sheet protection.SchDoc
size A4
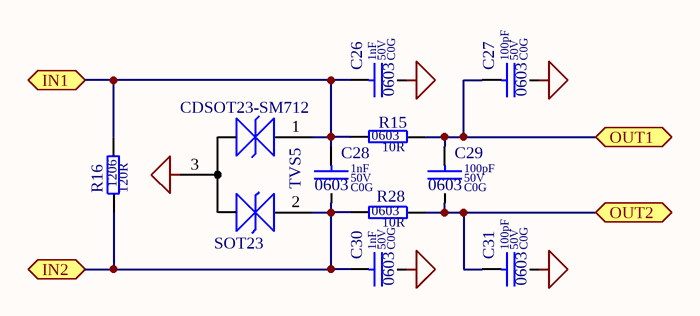
[diagram p3: protection.SchDoc]

### Parts
C26  value 1nF  Dielectric: C0G  Voltage: 50V  SCH_Footprint: 0603  [C_0603_1608]  (hidden comment: Ceramic C0G)
C27  value 100pF  Dielectric: C0G  Voltage: 50V  SCH_Footprint: 0603  [C_0603_1608]  (hidden comment: Ceramic C0G)
C28  value 1nF  Dielectric: C0G  Voltage: 50V  SCH_Footprint: 0603  [C_0603_1608]  (hidden comment: Ceramic C0G)
C29  value 100pF  Dielectric: C0G  Voltage: 50V  SCH_Footprint: 0603  [C_0603_1608]  (hidden comment: Ceramic C0G)
C30  value 1nF  Dielectric: C0G  Voltage: 50V  SCH_Footprint: 0603  [C_0603_1608]  (hidden comment: Ceramic C0G)
C31  value 100pF  Dielectric: C0G  Voltage: 50V  SCH_Footprint: 0603  [C_0603_1608]  (hidden comment: Ceramic C0G)
R15  value 10R  SCH_Footprint: 0603  [R_0603_1608]  (hidden comment: Resistor)
R16  value 120R  SCH_Footprint: 1206  [R_1206_3216]  (hidden comment: Resistor)
R28  value 10R  SCH_Footprint: 0603  [R_0603_1608]  (hidden comment: Resistor)
TVS5  value CDSOT23-SM712  SCH_Footprint: SOT23  [SOT23_N]  (hidden comment: TVS double bidirectional)

### Ports
IN1 (bidir), IN2 (bidir), OUT1 (bidir), OUT2 (bidir)

### Nets
GND: C26.2 C27.2 C30.2 C31.2 TVS5.3
NetC26_1: C26.1 C28.1 R15.2 R16.2 TVS5.1 ; port IN1
NetC27_1: C27.1 C29.1 R15.1 ; port OUT1
NetC28_2: C28.2 C30.1 R16.1 R28.2 TVS5.2 ; port IN2
NetC29_2: C29.2 C31.1 R28.1 ; port OUT2

### Library data of the parts
C26 C28 C30 = C_1nF_50V_C0G_0603_5: Capacitor; Manufacturer: Samsung; Manufacturer Part Number: CL10C102JB8NNNC; Tolerance (%): 5; Part Number: C_1nF_50V_C0G_0603_5; HelpURL: http://www.tme.eu/pl/Document/7da762c1dbaf553c64ad9c40d3603826/mlcc_samsung.pdf; Supplier 1: TME; Supplier Part Number 1: CL10C102JB8NNNC; Supplier 2: RS Components; Supplier 3: Farnell; Supplier 4: Mouser; Supplier 5: Digi-Key
C27 C29 C31 = C_100pF_50V_C0G_0603_5: Capacitor; Manufacturer: AVX; Manufacturer Part Number: 06035A101JAT2A; Tolerance (%): 5; Part Number: C_100pF_50V_C0G_0603_5; HelpURL: http://www.tme.eu/pl/Document/28556c2a4dfa60995042b7f5f1edb9ed/AVX-C0G.pdf; Supplier 1: TME; Supplier Part Number 1: 06035A101JAT2A; Supplier 2: RS Components; Supplier 3: Farnell; Supplier 4: Mouser; Supplier 5: Digi-Key
R15 R28 = R_10R_0603_1: as R9 on sheet LIFT_DRIVER; Part Number: R_10R_0603_1; HelpURL: http://www.tme.eu/pl/Document/b315665a56acbc42df513c99b390ad98/ROYALOHM-THICKFILM.pdf; Supplier 1: TME; Supplier Part Number 1: SMD0603-10R-1%; Supplier 2: RS Components; Supplier 3: Farnell; Supplier 4: Mouser; Supplier 5: Digi-Key
R16 = R_120R_1206_1: Manufacturer: Vishay; Manufacturer Part Number: CRCW1206120RFKEA; Voltage: 200V; Power: 250mW; Tolerance: 1%; Part Number: R_120R_1206_1; HelpURL: http://www.farnell.com/datasheets/2310790.pdf; Supplier 1: TME; Supplier 2: RS Components; Supplier Part Number 2: 6791787; Supplier 3: Farnell; Supplier Part Number 3: 1653057; Supplier 4: Mouser; Supplier Part Number 4: 71-CRCW1206-120-E3; Supplier 5: Digi-Key; Supplier Part Number 5: 541-120FCT-ND
TVS5 = TVS_CDSOT23-SM712: Manufacturer: Bourns; Voltage: 12V; Current: 17A; Part Number: TVS_CDSOT23-SM712; HelpURL: https://datasheet.octopart.com/CDSOT23-SM712-Bourns-datasheet-13451680.pdf; Manufacturer Part Number: CDSOT23-SM712; Supplier 1: TME; Supplier 2: RS Components; Supplier Part Number 2: 7673728; Supplier 3: Farnell; Supplier Part Number 3: 1824869; Supplier 4: Mouser; Supplier Part Number 4: 652-CDSOT23-SM712; Supplier 5: Digi-Key; Supplier Part Number 5: CDSOT23-SM712CT-ND

## Nets that join several sheets
+3.3V: LIFT_DRIVER (30 pins), TMC2209 (5 pins), LD39050PU33R (R12.2)
GND: LIFT_DRIVER (38 pins), TMC2209 (13 pins), LD39050PU33R (6 pins), protection (5 pins)
+12.0V: LIFT_DRIVER (J1.7 J1.8 J1.9 R24.1), TMC2209 (C1.1 C2.1 MOD1.16)
DIAG: LIFT_DRIVER (U2.25), TMC2209 (MOD1.17)
DIR: LIFT_DRIVER (U2.19), TMC2209 (MOD1.8)
ENABLE: LIFT_DRIVER (U2.26), TMC2209 (MOD1.1 R1.2)
LD_IN: LIFT_DRIVER (FB1.2), LD39050PU33R (C19.1 C20.1 U4.1 U4.6)
RX_U: LIFT_DRIVER (U2.22), TMC2209 (R6.1 R7.1)
STEP: LIFT_DRIVER (U2.20), TMC2209 (MOD1.7)
TX_U: LIFT_DRIVER (U2.21), TMC2209 (R5.1)